# EAGLE design h bridge1 (EAGLE 7.5.0)

## Sheet 1 of 2
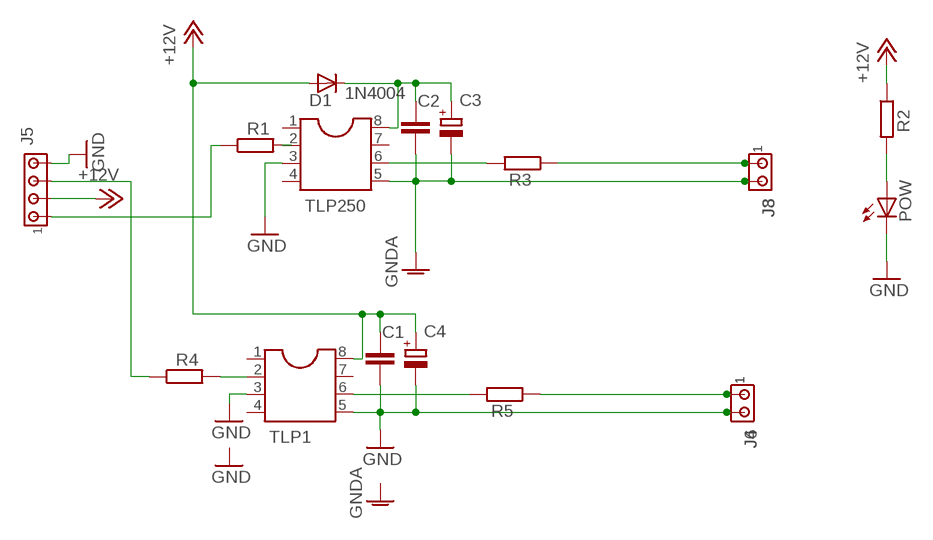
[diagram p0: schematic, sheet 1]

### Parts
C1  C-EU025-025X050  [C025-025X050]
C2  C-EU025-025X050  [C025-025X050]
C3  CPOL-EUE2.5-6  [E2,5-6]
C4  CPOL-EUE2.5-6  [E2,5-6]
D1  1N4004  [DO41-10]
J3  MTA02-100  [10X02MTA]
J4  MTA02-100  [10X02MTA]
J5  MTA04-100  [10X04MTA]
J6  MTA02-100  [10X02MTA]
J8  MTA02-100  [10X02MTA]
POW  LED3MM  [LED3MM]
R1  R-EU_0204/7  [0204/7]
R2  R-EU_0204/7  [0204/7]
R3  R-EU_0204/7  [0204/7]
R4  R-EU_0204/7  [0204/7]
R5  R-EU_0204/7  [0204/7]
TLP1  DIL8  [DIL08]
TLP250  DIL8  [DIL08]

### Nets
+12V: C1.1 C4.+ D1.A J5.2 R2.1 TLP1.8
GND: C1.2 C4.- J4.2 J5.4 J6.2 POW.K(C) TLP1.3 TLP1.5 TLP250.3
GNDA: C2.2 C3.- J3.2 J8.2 TLP250.5
N$1: R1.2 TLP250.2
N$2: J3.1 J8.1 R3.1
N$3: C2.1 C3.+ D1.C TLP250.8
N$4: R3.2 TLP250.6
N$5: J5.1 R1.1
N$6: POW.A R2.2
N$8: R5.2 TLP1.6
N$9: J4.1 J6.1 R5.1
N$11: R4.2 TLP1.2
N$13: J5.3 R4.1
Unconnected: TLP1.1 TLP1.4 TLP1.7 TLP250.1 TLP250.4 TLP250.7

## Sheet 2 of 2
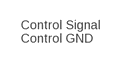
[diagram p1: schematic, sheet 2]

### Notes on the sheet
- Control Signal
  Control GND

## Library data of the parts
C1 C2 = rcl:C-EU: CAPACITOR, European symbol
C3 C4 = rcl:CPOL-EU: POLARIZED CAPACITOR, European symbol
D1 = adafruit:1N4004: DIODE General purpose 1N400x type rectifier (With bigger pads) http://www.ladyada.net/library/pcb/eaglelibrary.html
J3 J4 J6 J8 = con-amp:MTA02-100: AMP connector
J5 = con-amp:MTA04-100: AMP connector
POW = adafruit:LED: LED OSRAM: - CHIPLED LG R971, LG N971, LY N971, LG Q971, LY Q971, LO R971, LY R971 LH N974, LH R974 LS Q976, LO Q976, LY Q976 LO Q996 - Hyper CHIPLED LW Q18S LB Q993, LB Q99A, LB R99A - SideLED LS A670, LO A670, LY A670, LG A670, LP A670 LB A673, LV A673, LT A673, LW A673 LH A674 LY A675 LS A676, LA A676, LO A676, LY A676, LW A676 LS A679, LY A679, LG A679 - Hyper Micro SIDELED® LS Y876, LA Y876, LO Y876, LY Y876 LT Y87S - SmartLED LW L88C, LW L88S LB L89C, LB L89S, LG L890 LS L89K, LO L89K, LY L89K LS L896, LA L896, LO L896, LY L896 - TOPLED LS T670, LO T670, LY T670, LG T670, LP T670 LSG T670, LSP T670, LSY T670, LOP T670, LYG T670 LG T671, LOG T671, LSG T671 LB T673, LV T673, LT T673, LW T673 LH T674 LS T676, LA T676, LO T676, LY T676, LB T676, LH T676, LSB T676, LW T676 LB T67C, LV T67C, LT T67C, LS T67K, LO T67K, LY T67K, LW E67C LS E67B, LA E67B, LO E67B, LY E67B, LB E67C, LV E67C, LT E67C LW T67C LS T679, LY T679, LG T679 LS T770, LO T770, LY T770, LG T770, LP T770 LB T773, LV T773, LT T773, LW T773 LH T774 LS E675, LA E675, LY E675, LS T675 LS T776, LA T776, LO T776, LY T776, LB T776 LHGB T686 LT T68C, LB T68C - Hyper Mini TOPLED® LB M676 - Mini TOPLED Santana® LG M470 LS M47K, LO M47K, LY M47K Source: http://www.osram.convergy.de/
R1-R5 = rcl:R-EU_: RESISTOR, European symbol
TLP1 TLP250 = ic-package:DIL8: Dual In Line / Socket

## Net classes
1 Signal: width 1.27 mm, clearance 1.27 mm

## Board
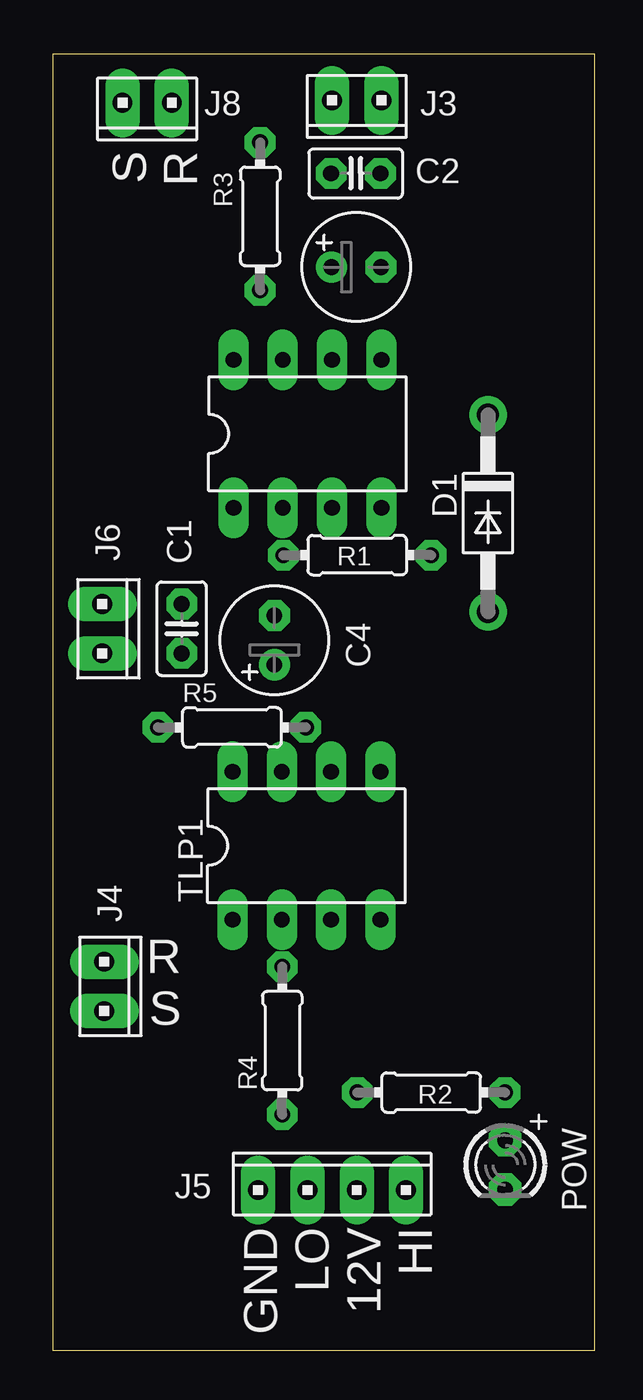
[diagram p2: board, top side]
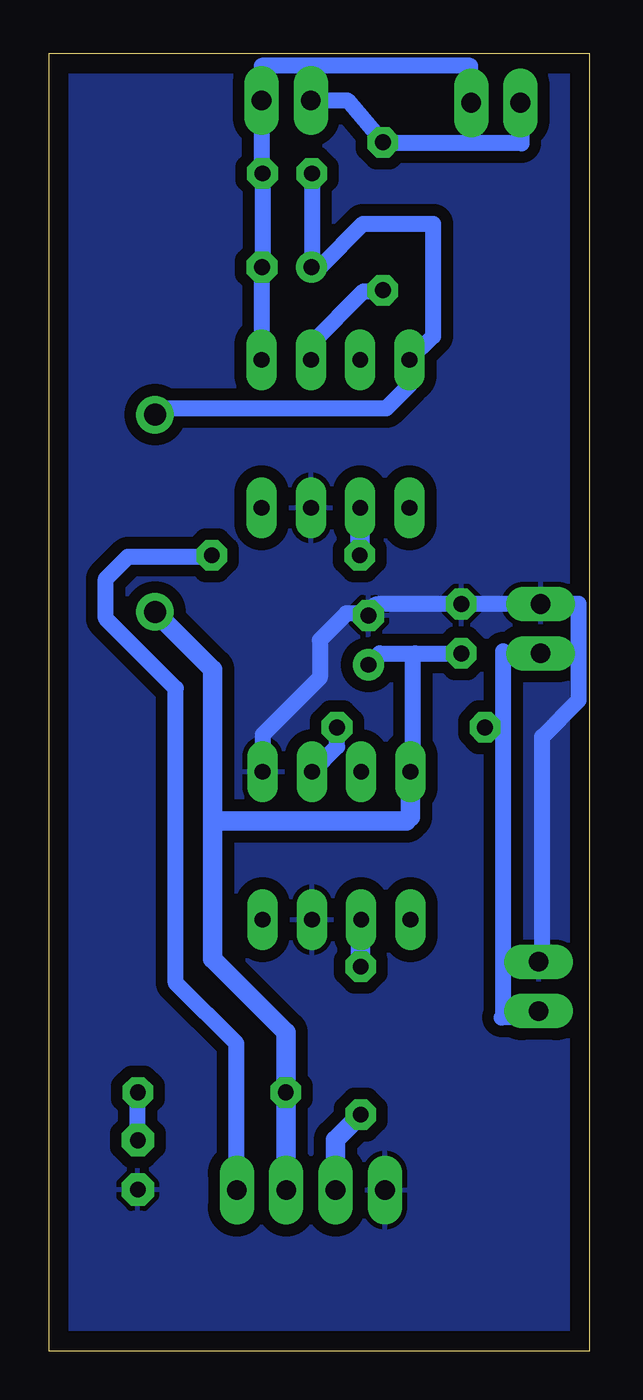
[diagram p3: board, bottom side, seen from below]

Size 27.89 x 66.8 mm. Coordinates in mm from the lower left corner, seen from the top.
Outline: 0,66.8 27.89,66.8 27.89,0 0,0 0,66.8
Copper layers (1*16): Top 0.035mm / dielectric 1.5mm / Bottom 0.035mm
Design rules "default *": minimum track width 50mil, minimum drill 40mil, track to track 8mil, track to pad 8mil, pad to pad 8mil, via to via 8mil, smd to smd 8mil, copper to edge 40mil, drill to drill 8mil, minimum pad ring 15mil, minimum via ring 50mil, stop-mask expansion 4mil, vias tented up to drill 0mil, thermal gap 10mil
tRestrict: area 36.3,-4.6 to 63,61.4
vRestrict: area -217.3,35.1 to -195,54.4

### Footprints (pad centres in the part's own frame; a part is rotated, then mirrored left to right if it is on the bottom)
C025-025X050 = drill 0.813 octagon: 1 -1.27,0; 2 1.27,0
E2,5-6 = drill 0.813 pad 1.6: + -1.27,0 | drill 0.813 pad 1.6 octagon: - 1.27,0
DO41-10 = drill 1.118 pad 1.93: A 5.08,0; C -5.08,0
10X02MTA = drill 1.016 long: 1 1.27,0; 2 -1.27,0
10X04MTA = drill 1.016 long: 1 3.81,0; 2 1.27,0; 3 -1.27,0; 4 -3.81,0
LED3MM = drill 0.813 pad 1.676 octagon: A -1.27,0; K 1.27,0
0204/7 = drill 0.813 octagon: 1 -3.81,0; 2 3.81,0
DIL08 = drill 0.813 long: 1 -3.81,-3.81; 2 -1.27,-3.81; 3 1.27,-3.81; 4 3.81,-3.81; 5 3.81,3.81; 6 1.27,3.81; 7 -1.27,3.81; 8 -3.81,3.81

### Placement (x,y rotation side)
C1  6.63,37.19 90 top
C2  15.6,60.63 0 top
C3  15.62,55.8 0 top
C4  11.4,36.6 90 top
D1  22.4,43.13 270 top
J3  15.65,64.39 180 top
J4  2.64,18.77 270 top
J5  14.38,8.28 0 top
J6  2.54,37.19 270 top
J8  4.85,64.26 180 top
POW  23.29,9.58 270 top
R1  15.67,40.97 180 top
R2  19.48,13.31 0 top
R3  10.67,58.42 270 top
R4  11.81,15.98 90 top
R5  9.22,32.11 0 top
TLP1  13.06,26.01 0 top
TLP250  13.11,47.22 0 top

### Tracks (layer width: path | path; a pad name or v marks a point on that pad's centre or on a via)
+12V
  Bottom 0.813: TLP1.8 9.12,29.95 9.12,35.79 8.99,35.92 | 8.99,35.92 C1.1 | C4.+ 10.82,35.92 8.99,35.92 | R2.1 15.67,14.4 15.65,14.43
  Bottom 1.016: J5.2 15.65,14.43 15.65,16.41 19.43,20.19 19.43,27.28 | TLP1.8 9.25,27.48 9.45,27.28 19.43,27.28 | D1.A 19.43,35.08 19.43,27.28
GND
  Bottom 0.813: 2.64,20.02 J4.2 2.46,20.22 2.46,31.62 0.58,33.5 0.58,38.48 0.61,38.46 J6.2 C1.2 10.82,38.46 arc-90 C4.- 11.51,37.97 12.55,37.97 13.92,36.6 13.92,34.67 16.87,31.72 TLP1.5
  pour Bottom (isolate 0.61): 0.05,66.73 27.74,66.73 27.74,0.13 0.05,0.13
GNDA
  Bottom 0.813: J8.2 6.17,64.26 6.17,66.17 16.92,66.17 J3.2 16.92,60.68 C2.2 16.87,56.29 C3.- 16.89,51.05 TLP250.5
N$1
  Bottom 1.016: R1.2 11.84,41 TLP250.2
N$2
  Bottom 0.813: J8.1 3.53,64.26 3.53,62.18 10.26,62.18 R3.1 12.5,64.39 J3.1
N$3
  Bottom 0.813: C2.1 14.33,56.29 C3.+ 13.92,55.8 11.68,58.04 8.08,58.04 8.08,52.25 TLP250.8 9.3,49.73 10.49,48.54 22.07,48.54 D1.C
N$4
  Bottom 0.813: TLP250.6 14.38,51.84 11.66,54.56 10.72,54.56 R3.2
N$5
  Bottom 0.813: J5.1 18.21,8.28 18.21,15.82 21.34,18.95 21.34,34.11 24.94,37.72 24.94,39.75 23.8,40.89 19.56,40.89 R1.1
N$6
  Bottom 0.813: POW.A R2.2
N$8
  Bottom 0.813: TLP1.6 13.03,31.12 R5.2
N$9
  Bottom 0.813: J4.1 2.97,17.17 4.55,17.17 4.47,17.25 4.47,31.98 | 4.47,31.98 4.47,36.02 4.37,35.92 J6.1 | R5.1 5.28,31.98 4.47,31.98
N$11
  Bottom 1.016: R4.2 11.81,22.17 TLP1.2
N$13
  Bottom 1.016: J5.3 13.11,10.87 R4.1

### Text on the board
tNames: S / R | R / S | GND / LO / 12V / HI